# EAGLE design Polaris (EAGLE 6.4)
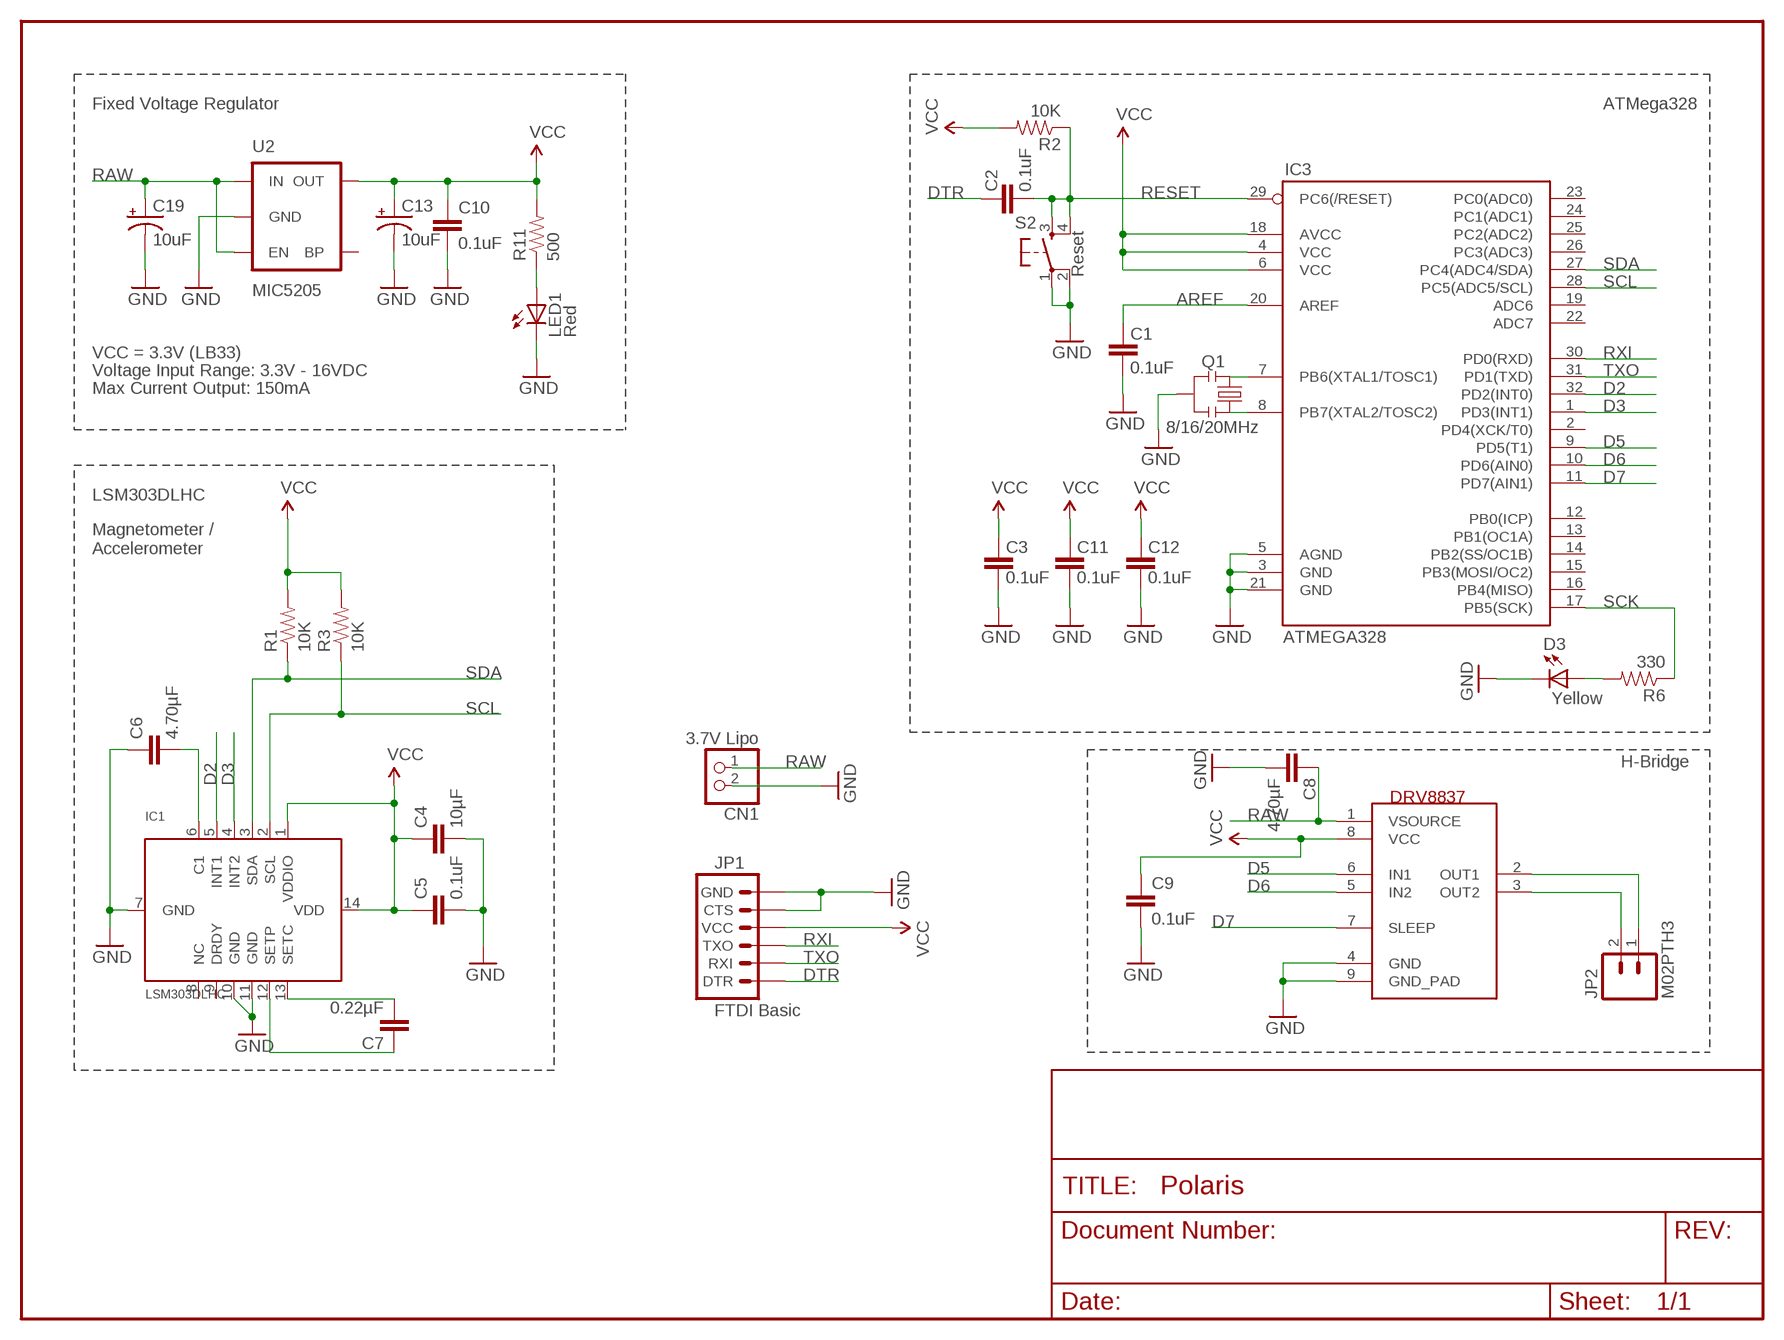
[diagram p0: schematic, sheet 1]

## Parts
C1  0.1uF  CAP0805  [0805]
C2  0.1uF  CAP0805  [0805]
C3  0.1uF  CAP0805  [0805]
C4  10µF  CAP0805  [0805]
C5  0.1uF  CAP0805  [0805]
C6  4.70µF  CAP0805  [0805]
C7  0.22µF  CAP0805  [0805]
C8  4.70µF  CAP0805  [0805]
C9  0.1uF  CAP0805  [0805]
C10  0.1uF  CAP0805  [0805]
C11  0.1uF  CAP0805  [0805]
C12  0.1uF  CAP0805  [0805]
C13  10uF  CAP_POL1206  [EIA3216]
C19  10uF  CAP_POL1206  [EIA3216]
CN1  3.7V Lipo  JST_2PIN-THM-RA  [JST-PH-2-THM-RA]
D3  Yellow  LED-YELLOWLILYPAD  [LED-1206]
IC1  LSM303DLHC  [LGA14]
IC2  DRV8837  [WSON-8]
IC3  ATMEGA328  ATMEGA168  [TQFP32-08]
JP1  FTDI Basic  ARDUINO_SERIAL_PROGRAMPTH  [1X06]
JP2  M02PTH3  [1X02_LONGPADS]
LED1  Red  LED-RED1206  [LED-1206]
Q1  8/16/20MHz  RESONATORSMD  [RESONATOR-SMD]
R1  10K  RESISTOR0805-RES  [0805]
R2  10K  RESISTOR0805-RES  [0805]
R3  10K  RESISTOR0805-RES  [0805]
R6  330  RESISTOR0805-RES  [0805]
R11  500  RESISTOR0805-RES  [0805]
S2  Reset  TAC_SWITCHSMD  [TACTILE_SWITCH_SMD]
U2  MIC5205  V_REG_LDOSMD  [SOT23-5]

## Nets
3.3V: C3.2 C4.1 C5.1 C9.1 C10.1 C11.2 C12.2 C13.A(+) IC1.1(VDDIO) IC1.14(VDD) IC2.8(VCC) IC3.4(VCC) IC3.6(VCC) IC3.18(AVCC) JP1.4(VCC) R1.2 R2.2 R3.2 R11.2 U2.5(OUT) ; supply symbol labelled VCC
AREF: C1.2 IC3.20(AREF)
D2: IC1.5(INT1) IC3.32(PD2(INT0))
D3: IC1.4(INT2) IC3.1(PD3(INT1))
D5: IC2.6(IN1) IC3.9(PD5(T1))
D6: IC2.5(IN2) IC3.10(PD6(AIN0))
D7: IC2.7(SLEEP) IC3.11(PD7(AIN1))
DTR: C2.2 JP1.1(DTR)
GND [vcc]: C1.1 C3.1 C4.2 C5.2 C6.1 C8.2 C9.2 C10.2 C11.1 C12.1 C13.C(-) C19.C(-) CN1.2 D3.C IC1.7(GND) IC1.10(GND) IC1.11(GND) IC2.4(GND) IC2.9(GND_PAD) IC3.3(GND) IC3.5(AGND) IC3.21(GND) JP1.5(CTS) JP1.6(GND) LED1.C Q1.2 S2.1 S2.2 U2.2(GND)
N$1: IC3.8(PB7(XTAL2/TOSC2)) Q1.1
N$2: IC3.7(PB6(XTAL1/TOSC1)) Q1.3
N$3: C6.2 IC1.6(C1)
N$4: C7.1 IC1.12(SETP)
N$5: C7.2 IC1.13(SETC)
N$7: D3.A R6.2
N$9: IC2.3(OUT2) JP2.2
N$10: IC2.2(OUT1) JP2.1
N$38: LED1.A R11.1
RAW [vcc]: C8.1 C19.A(+) CN1.1 IC2.1(VSOURCE) U2.1(IN) U2.3(EN)
RESET: C2.1 IC3.29(PC6(/RESET)) R2.1 S2.3 S2.4
RXI: IC3.30(PD0(RXD)) JP1.3(TXO)
SCK: IC3.17(PB5(SCK)) R6.1
SCL: IC1.2(SCL) IC3.28(PC5(ADC5/SCL)) R3.1
SDA: IC1.3(SDA) IC3.27(PC4(ADC4/SDA)) R1.1
TXO: IC3.31(PD1(TXD)) JP1.2(RXI)
Unconnected: IC1.8(NC) IC1.9(DRDY) IC3.2(PD4(XCK/T0)) IC3.12(PB0(ICP)) IC3.13(PB1(OC1A)) IC3.14(PB2(SS/OC1B)) IC3.15(PB3(MOSI/OC2)) IC3.16(PB4(MISO)) IC3.19(ADC6) IC3.22(ADC7) IC3.23(PC0(ADC0)) IC3.24(PC1(ADC1)) IC3.25(PC2(ADC2)) IC3.26(PC3(ADC3)) U2.4(BP)

## Notes on the sheet
- Fixed Voltage Regulator | ATMega328
- VCC = 3.3V (LB33)
- Voltage Input Range: 3.3V - 16VDC
- Max Current Output: 150mA
- LSM303DLHC
- Magnetometer /
  Accelerometer
- H-Bridge

## Library data of the parts
C1-C12 = SparkFun-Capacitors:CAP: Capacitor Standard 0603 ceramic capacitor, and 0.1" leaded capacitor.
C13 C19 = SparkFun:CAP_POL: Capacitor Polarized These are standard SMD and PTH capacitors. Normally 10uF, 47uF, and 100uF in electrolytic and tantalum varieties. Always verify the external diameter of the through hole cap, it varies with capacity, voltage, and manufacturer. The EIA devices should be standard.
CN1 = adafruit:JST_2PIN: JST 2-Pin Connectors of various flavors SMT-RA (S2B-PH-SM4) 4UConnector #17311 SMT (B2B-PH-SM4) THM-RA (S2B-PH) THM (B2B-PH)
D3 = SparkFun-LED:LED-YELLOW: Yellow SMD LEDs LilyPad 1206- DIO-09909 0603- DIO-09003; PROD_ID: DIO-09909
IC1 = microbuilder:LSM303DLHC: LSM303DLHC 3-Axis I2C Accelerometer and 3-Axis Magnetometer VDD: 2.2-3.6V VDDIO: 1.8-VDD Magnetic Range: +/-1.3 to +/-8.1 gauss Accel Range: +/-2/4/8/16 g Temp: -40 - 85°C
IC2 = digikey:DRV8837: DRV8837 DSG - H-Bridge
IC3 = SparkFun:ATMEGA168
JP1 = SparkFun:ARDUINO_SERIAL_PROGRAM
JP2 = SparkFun-Connectors:M02: Standard 2-pin 0.1" header. Use with - straight break away headers ( PRT-00116) - right angle break away headers (PRT-00553) - swiss pins (PRT-00743) - machine pins (PRT-00117) - female headers (PRT-00115) Molex polarized connector foot print use with: PRT-08233 with associated crimp pins and housings. 2.54_SCREWTERM for use with PRT-10571. 3.5mm Screw Terminal footprints for PRT-08084 5mm Screw Terminal footprints for use with PRT-08433
LED1 = SparkFun-LED:LED-RED: Assorted Red LEDs LilyPad 1206- DIO-09912 1206- DIO-00809 0603- DIO-00819; PROD_ID: DIO-00809; VALUE: RED
Q1 = SparkFun:RESONATOR: Resonator Small SMD resonator. This is the itty bitty 10/20MHz resonators with built in caps. CSTCE10M0G55 and CSTCE20M0V53. Footprint has been reviewed closely but hasn't been tested yet.
R1-R3 R6 R11 = SparkFun-Resistors:RESISTOR: Resistor Basic schematic elements and footprints for 0603, 1206, and PTH resistors.
S2 = SparkFun:TAC_SWITCH: Momentary Switch Button commonly used for reset or general input. Spark Fun Electronics SKU : COM-00097
U2 = SparkFun:V_REG_LDO: Voltage Regulator LDO Standard 150mA LDO voltage regulator in SOT-23 layout. Micrel part MIC5205. BP (by-pass) pin is used to lower output noise with 470pF cap.

## Net classes
0 default: width 0.203 mm
1 vcc: width 0.254 mm

## Board
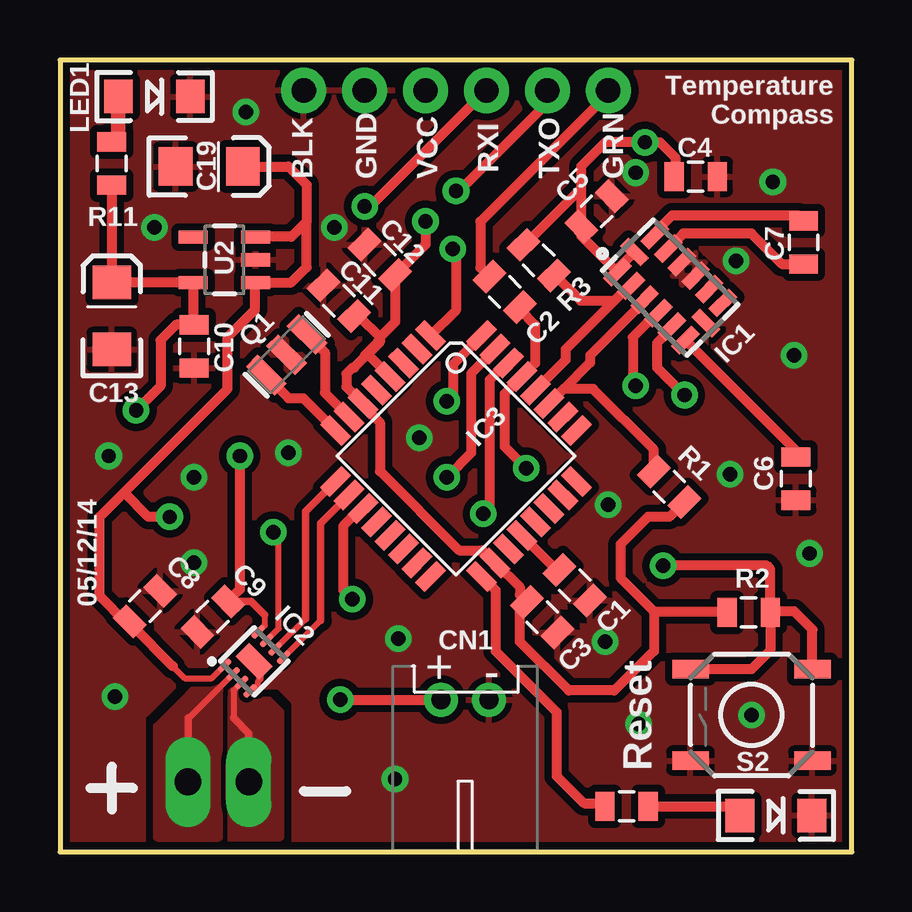
[diagram p1: board, top side]
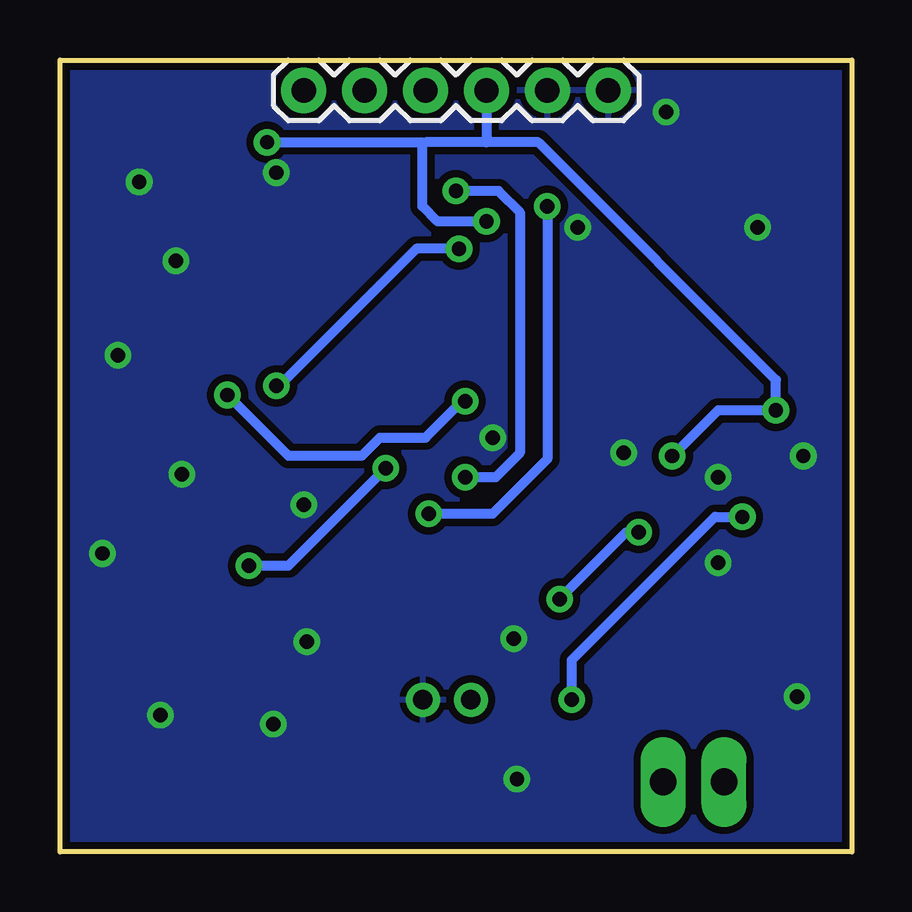
[diagram p2: board, bottom side, seen from below]

Size 33.02 x 33.02 mm. Coordinates in mm from the lower left corner, seen from the top.
Outline: 0,33.02 0,0 33.02,0 33.02,33.02 0,33.02
Copper layers (1*16): Top 0.035mm / dielectric 1.5mm / Bottom 0.035mm
Design rules "default *": minimum track width 8mil, minimum drill 20mil, track to track 8mil, track to pad 8mil, pad to pad 8mil, via to via 8mil, smd to smd 8mil, copper to edge 8mil, drill to drill 8mil, minimum pad ring 12mil, minimum via ring 10mil, stop-mask expansion 4mil, vias tented up to drill 25mil, thermal gap 10mil

### Footprints (pad centres in the part's own frame; a part is rotated, then mirrored left to right if it is on the bottom)
0805 = smd 0.8 x 1.2: 1 -0.9,0; 2 0.9,0
EIA3216 = smd 1.4 x 1.6: A 1.4,0; C -1.4,0
JST-PH-2-THM-RA = drill 0.8 pad 1.422: 1 1,0; 2 -1,0
LED-1206 = smd 1.2 x 1.4: A -1.5,0; C 1.5,0
LGA14 = smd 0.5 x 1.2: 1 2,1.1; 2 1.2,1.1; 3 0.4,1.1; 4 -0.4,1.1; 5 -1.2,1.1; 6 -2,1.1; 8 -2,-1.1; 9 -1.2,-1.1; 10 -0.4,-1.1; 11 0.4,-1.1; 12 1.2,-1.1; 13 2,-1.1 | smd 1.2 x 0.5: 7 -2.1,0; 14 2.1,0
WSON-8 = smd 0.7 x 0.279: 1 -0.99,0.75; 2 -0.99,0.25; 3 -0.99,-0.25; 4 -0.99,-0.75; 5 0.99,-0.75; 6 0.99,-0.25; 7 0.99,0.25; 8 0.99,0.75 | smd 0.8 x 1.38: 9 0,0
TQFP32-08 = smd 1.27 x 0.559: 1 -4.293,2.8; 2 -4.293,2; 3 -4.293,1.2; 4 -4.293,0.4; 5 -4.293,-0.4; 6 -4.293,-1.2; 7 -4.293,-2; 8 -4.293,-2.8; 17 4.293,-2.8; 18 4.293,-2; 19 4.293,-1.2; 20 4.293,-0.4; 21 4.293,0.4; 22 4.293,1.2; 23 4.293,2; 24 4.293,2.8 | smd 0.559 x 1.27: 9 -2.8,-4.293; 10 -2,-4.293; 11 -1.2,-4.293; 12 -0.4,-4.293; 13 0.4,-4.293; 14 1.2,-4.293; 15 2,-4.293; 16 2.8,-4.293; 25 2.8,4.293; 26 2,4.293; 27 1.2,4.293; 28 0.4,4.293; 29 -0.4,4.293; 30 -1.2,4.293; 31 -2,4.293; 32 -2.8,4.293
1X06 = drill 1.016 pad 1.88: 1 0,0; 2 2.54,0; 3 5.08,0; 4 7.62,0; 5 10.16,0; 6 12.7,0
1X02_LONGPADS = drill 1.118 pad 1.88 long: 1 0,0; 2 2.54,0
RESONATOR-SMD = smd 0.7 x 1.7: 1 -1.2,0; 2 0,0; 3 1.2,0
TACTILE_SWITCH_SMD = smd 1.524 x 0.762: 1 -2.54,1.905; 2 2.54,1.905; 3 -2.54,-1.905; 4 2.54,-1.905
SOT23-5 = smd 0.55 x 1.2: 1 -0.95,-1.3; 2 0,-1.3; 3 0.95,-1.3; 4 0.95,1.3; 5 -0.95,1.3

### Placement (x,y rotation side)
C1  21.46,11.12 135 top
C2  18.54,23.35 135 top
C3  20.1,9.79 135 top
C4  26.51,28.16 0 top
C5  22.37,26.71 45 top
C6  30.68,15.57 90 top
C7  31,25.42 90 top
C8  3.54,10.25 45 top
C9  6.37,9.82 225 top
C10  5.59,21.08 270 top
C11  11.63,22.99 315 top
C12  13.34,24.69 315 top
C13  2.16,22.35 90 top
C19  6.22,28.57 0 top
CN1  16.89,6.35 180 top
D3  29.84,1.52 0 top
IC1  25.44,23.53 135 top
IC2  8.1,7.95 45 top
IC3  16.51,16.51 315 top
JP1  22.86,31.75 0 bottom
JP2  5.33,2.92 0 top
LED1  3.94,31.5 0 top
Q1  9.45,20.73 45 top
R1  25.39,15.22 315 top
R2  28.71,9.99 180 top
R3  19.95,24.68 135 top
R6  23.62,1.91 0 top
R11  2.16,28.7 270 top
S2  28.83,5.71 180 top
U2  6.86,24.69 90 top

### Tracks (layer width: path | path; a pad name or v marks a point on that pad's centre or on a via)
3.3V  (via drill 0.6)
  Top 0.254: 8.53,9.88 8.53,9.45 IC2.8
  Top 0.305: C9.1 7.96,10.45 8.53,9.88
  Top 0.406: R11.2 C13.A 5.54,23.75 U2.5 5.56,22.01 C10.1 4.84,21.98 4.19,21.34 4.19,19.43 v3.17,18.41 | v7.49,16.51 7.49,10.94 C9.1 | IC1.14 23.25,24.31 IC1.1 21.73,25.68 C5.1 21.73,27.69 | 21.73,27.69 21.73,28.59 22.73,29.59 v24.38,29.59 25.02,29.59 25.65,28.96 25.65,28.2 C4.1 25.61,28.37 | R3.2 19.36,25.31 21.73,27.69 | R1.2 26.02,14.59 25.4,13.97 24.51,13.97 23.37,12.83 23.37,11.43 24.77,10.03 | 13.34,21.46 13.97,22.1 C12.2 15.24,25.32 v15.24,26.29 | 13.34,21.46 13.34,21.26 | 13.34,21.26 12.27,20.19 12.19,20.19 11.94,19.94 11.94,19.39 IC3.6 12.63,18.62 13.34,17.91 13.34,15.88 16.64,12.57 17.62,12.57 IC3.18 18.17,12.06 19.18,11.05 19.18,10.72 C3.2 19.18,10.14 19.18,8.76 21.21,6.73 23.11,6.73 24.77,8.38 24.77,10.03 | C11.2 12.45,22.35 13.34,21.46 | 13.34,21.26 13.26,21.26 12.7,20.7 12.88,20.7 IC3.4 | 24.77,10.03 27.77,10.03 R2.2
  Bottom 0.406: v7.49,16.51 5.59,18.41 v3.17,18.41 3.17,19.68 13.08,29.59 15.24,29.59 | JP1.4 15.24,29.59 | 15.24,29.59 17.78,29.59 17.91,29.46 | v15.24,26.29 17.27,26.29 17.91,26.92 17.91,29.46 | v24.38,29.59 17.91,29.59 17.91,29.46
AREF
  Top 0.406: C1.2 20.7,11.76 IC3.20
D2  (via drill 0.6)
  Top 0.406: IC1.5 25.51,21.82 24.89,21.21 24.89,20.19 v26.04,19.05 | IC3.32 17.57,21.38 17.44,21.38 16.38,20.32 16.38,19.05 v16.13,18.8
  Bottom 0.406: 25.78,19.05 v26.04,19.05 23.5,16.51 20.45,16.51 19.68,17.27 17.78,17.27 16.26,18.8 v16.13,18.8
D3  (via drill 0.6)
  Top 0.406: IC1.4 24.89,22.47 23.88,21.46 23.88,19.56 v24,19.43 | IC3.1 16.51,22.58 16.51,25.02 v16.38,25.15
  Bottom 0.406: v24,19.43 23.88,19.43 18.16,25.15 v16.38,25.15
D5
  Top 0.254: 10.24,9.73 10.23,9.73 IC2.6
  Top 0.305: 10.24,9.73 10.24,14.2 IC3.9
D6
  Top 0.254: 10.87,9.65 10.86,9.65 IC2.5
  Top 0.305: 10.87,9.65 10.87,13.7 IC3.10
D7  (via drill 0.6)
  Top 0.254: IC2.7 9.12,9.32 9.12,13.11 v8.89,13.34
  Top 0.406: IC3.11 12.54,14.32 11.81,13.59 11.81,10.92 v12.19,10.54
  Bottom 0.406: v8.89,13.34 9.4,13.34 v12.19,10.54
DTR
  Top 0.406: JP1.1 22.73,31.75 22.73,31.5 17.53,26.29 17.53,24.36 C2.2
GND  (via drill 0.6)
  Top 0.254: IC2.9 8.38,7.66 8.38,7.24 8.26,7.11 8.26,6.73 8.24,6.72 IC2.4
  other vias: 22.73,8.76 24,28.32 14.99,17.27 14.1,8.89 9.53,16.64 28.19,24.64 22.86,14.48 7.75,30.86 29.72,27.94 31.24,12.45 2.29,6.48 13.97,3.05 5.59,15.62 2.03,16.51 3.94,26.04 11.43,26.04 27.94,15.75 30.61,20.7 24.13,5.33 5.59,12.06 28.83,5.71
  pour Top (isolate 0.305, rank 3): 0,33.02 33.02,33.02 33.02,0 0,0
  pour Bottom (isolate 0.305): 0,33.02 33.02,33.02 33.02,0 0,0
N$1
  Top 0.406: Q1.1 8.6,19.85 9.53,18.92 10.14,18.92 IC3.8
N$2
  Top 0.406: Q1.3 11.05,20.83 11.05,19.14 IC3.7
N$3
  Top 0.406: C6.2 30.73,16.47 30.73,16.68 IC1.6
N$4
  Top 0.406: IC1.12 25.99,25.78 28.83,25.78 30.1,24.51 C7.1
N$5
  Top 0.406: IC1.13 24.8,25.82 25.53,26.54 30.78,26.54 C7.2
N$7
  Top 0.406: R6.2 27.96,1.91 D3.A
N$9
  Top 0.254: IC2.3 7.24,6.73 7.24,5.59
  Top 0.305: 7.24,5.59 7.87,4.95 JP2.2
  pour Top (rank 2, no thermals): 6.73,0.64 6.73,6.22 7.75,7.24 9.14,5.84 9.14,0.64
N$10
  Top 0.254: 5.33,5.59 5.38,5.59 IC2.2
  Top 0.305: 5.33,5.59 JP2.1
  pour Top (no thermals): 6.6,0.64 6.6,6.73 7.37,7.49 7.11,7.75 6.6,7.75 4.06,5.21 4.06,0.64
N$38
  Top 0.61: LED1.A 2.44,29.88 R11.1
RAW  (via drill 0.6)
  Top 0.254: 4.7,7.75 5.21,7.24 6.33,7.24 IC2.1
  Top 0.406: 2.67,14.99 1.65,13.97 1.65,10.67 2.79,9.53 2.92,9.53 2.98,9.46 | 2.67,14.99 6.99,19.3 6.99,21.46 8.13,22.61 8.13,23.71 U2.1 9.64,23.74 10.29,24.38 10.29,26.29 | C19.A 9.53,28.57 10.29,27.81 10.29,26.29 | 10.29,26.29 9.65,25.65 8.17,25.65 U2.3 | v11.68,6.35 CN1.1 | 2.98,9.46 4.7,7.75 | C8.1 2.98,9.61 2.98,9.46 | v4.57,13.97 3.68,13.97 2.67,14.99
  Bottom 0.406: v11.68,6.35 11.68,8 5.71,13.97 v4.57,13.97
RESET  (via drill 0.6)
  Top 0.406: S2.3 31.37,9.27 30.61,10.03 29.66,10.03 R2.1 | R2.1 29.61,8.4 28.83,7.62 S2.4 | R2.1 29.61,11.79 29.46,11.94 v25.15,11.94 | C2.1 19.18,22.61 19.81,21.97 19.81,20.38 IC3.29 18.54,19.11 18.54,16.89 v19.43,16
  Bottom 0.406: v25.15,11.94 23.5,11.94 v19.43,16
RXI  (via drill 0.6)
  Top 0.406: JP1.3 12.95,26.92 v12.7,26.92 | IC3.30 18.62,20.39 17.91,19.68 17.91,14.35 v17.65,14.1
  Bottom 0.406: v12.7,26.92 12.7,16.38 14.99,14.1 v17.65,14.1
SCK
  Top 0.406: IC3.17 17.59,11.49 18.16,10.92 18.16,8.38 20.7,5.84 20.7,3.17 21.84,2.03 22.59,2.03 R6.1
SCL
  Top 0.406: IC1.2 23.73,23.6 23.37,23.24 23.11,22.99 | 23.11,22.99 21.08,20.95 21.08,20.52 IC3.28 | R3.1 20.66,24.04 21.72,22.99 23.11,22.99
SDA
  Top 0.406: IC1.3 24.38,22.98 22.1,20.7 22.1,20.4 21,19.3 | IC3.27 20.98,19.28 21,19.3 | R1.1 24.76,16.77 22.23,19.3 21,19.3
TXO  (via drill 0.6)
  Top 0.406: JP1.2 20.32,31.24 16.76,27.69 16.51,27.69 v16.51,27.56 | IC3.31 18.13,20.93 17.14,19.94 17.14,16.64 v16.13,15.62
  Bottom 0.406: v16.51,27.56 14.73,27.56 13.84,26.67 13.84,16.64 14.86,15.62 v16.13,15.62 16,15.75

### Text on the board
tPlace: BLK | GND | VCC | RXI | TXO | GRN | Reset
tNames: Temperature / Compass | 05/12/14